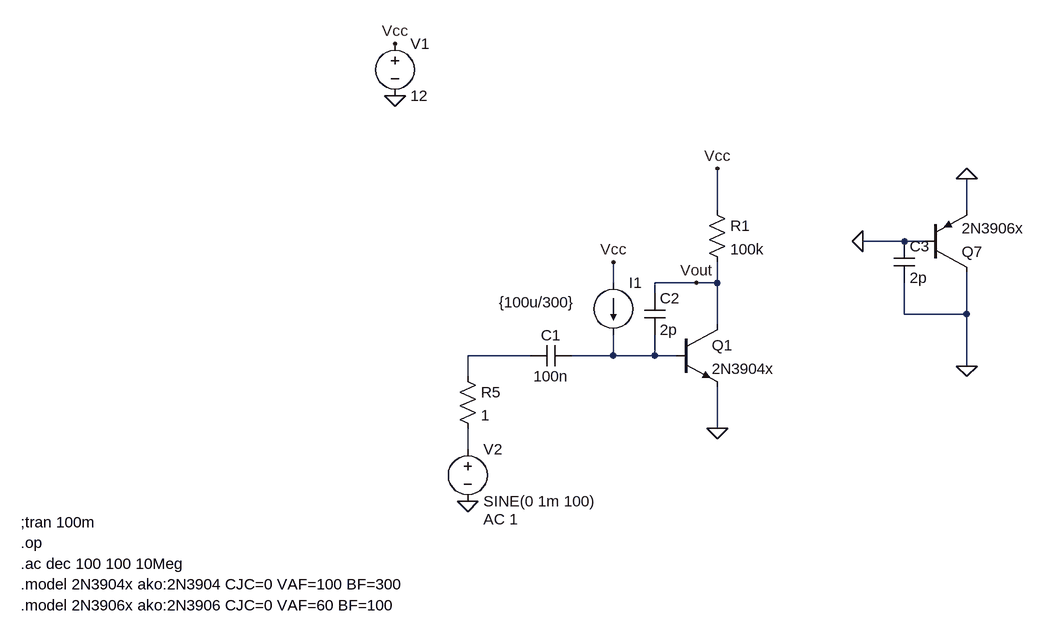
[diagram p0: schematic BJT_1stage_BW.asc]
BJT_1stage_BW.asc, the LTspice schematic file:
Version 4
SHEET 1 1872 680
WIRE 640 16 640 -48
WIRE 1024 16 1024 -32
WIRE 928 64 864 64
WIRE 960 64 928 64
WIRE 480 128 480 96
WIRE 608 128 544 128
WIRE 640 128 640 96
WIRE 640 128 608 128
WIRE 544 144 544 128
WIRE 928 176 928 128
WIRE 1024 176 1024 112
WIRE 1024 176 928 176
WIRE 640 192 640 128
WIRE 352 240 256 240
WIRE 480 240 480 208
WIRE 480 240 416 240
WIRE 544 240 544 208
WIRE 544 240 480 240
WIRE 576 240 544 240
WIRE 1024 256 1024 176
WIRE 256 272 256 240
WIRE 640 352 640 288
WIRE 256 384 256 352
FLAG 640 352 0
FLAG 256 464 0
FLAG 144 -160 0
FLAG 144 -240 Vcc
FLAG 480 96 Vcc
FLAG 640 -48 Vcc
FLAG 1024 256 0
FLAG 864 64 0
FLAG 1024 -32 0
FLAG 608 128 Vout
SYMBOL npn 576 192 R0
SYMATTR InstName Q1
SYMATTR Value 2N3904x
SYMBOL voltage 256 368 R0
WINDOW 123 24 124 Left 2
WINDOW 39 0 0 Left 0
SYMATTR Value2 AC 1
SYMATTR InstName V2
SYMATTR Value SINE(0 1m 100)
SYMBOL pnp 960 112 M180
SYMATTR InstName Q7
SYMATTR Value 2N3906x
SYMBOL res 240 256 R0
SYMATTR InstName R5
SYMATTR Value 1
SYMBOL cap 416 224 R90
WINDOW 0 0 32 VBottom 2
WINDOW 3 32 32 VTop 2
SYMATTR InstName C1
SYMATTR Value 100n
SYMBOL voltage 144 -256 R0
WINDOW 123 0 0 Left 0
WINDOW 39 0 0 Left 0
SYMATTR InstName V1
SYMATTR Value 12
SYMBOL current 480 128 R0
WINDOW 3 -176 30 Left 2
WINDOW 123 0 0 Left 0
WINDOW 39 0 0 Left 0
SYMATTR Value {100u/300}
SYMATTR InstName I1
SYMBOL res 624 0 R0
SYMATTR InstName R1
SYMATTR Value 100k
SYMBOL cap 528 144 R0
SYMATTR InstName C2
SYMATTR Value 2p
SYMBOL cap 912 64 R0
SYMATTR InstName C3
SYMATTR Value 2p
TEXT -432 592 Left 2 !.model 2N3904x ako:2N3904 CJC=0 VAF=100 BF=300
TEXT -432 496 Left 2 !;tran 100m
TEXT -432 560 Left 2 !.ac dec 100 100 10Meg
TEXT -432 624 Left 2 !.model 2N3906x ako:2N3906 CJC=0 VAF=60 BF=100
TEXT -432 528 Left 2 !.op

The netlist it stands for:
* BJT_1stage_BW.asc
Q1 Vout N002 0 0 2N3904x
V2 N003 0 SINE(0 1m 100) AC 1
Q7 0 0 0 0 2N3906x
R5 N001 N003 1
C1 N002 N001 100n
V1 Vcc 0 12
I1 Vcc N002 {100u/300}
R1 Vcc Vout 100k
C2 Vout N002 2p
C3 0 0 2p
.model NPN NPN
.model PNP PNP
.lib standard.bjt
.model 2N3904x ako:2N3904 CJC=0 VAF=100 BF=300
;tran 100m
.ac dec 100 100 10Meg
.model 2N3906x ako:2N3906 CJC=0 VAF=60 BF=100
.op
.backanno
.end